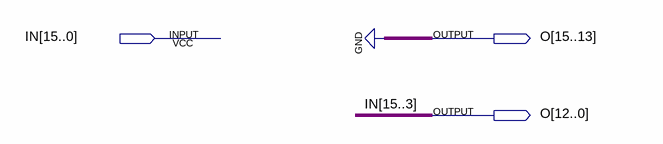
[diagram p0: schematic sheet]
// Quartus schematic SHIFTER3.bdf as structural Verilog: 0 symbols, 3 pins
module SHIFTER3 (
  input  [15:0] IN,
  output [15:0] O
);


  assign O = {3'b000, IN[15:3]};
endmodule
